# EAGLE schematic scrap (EAGLE 7.1.0)
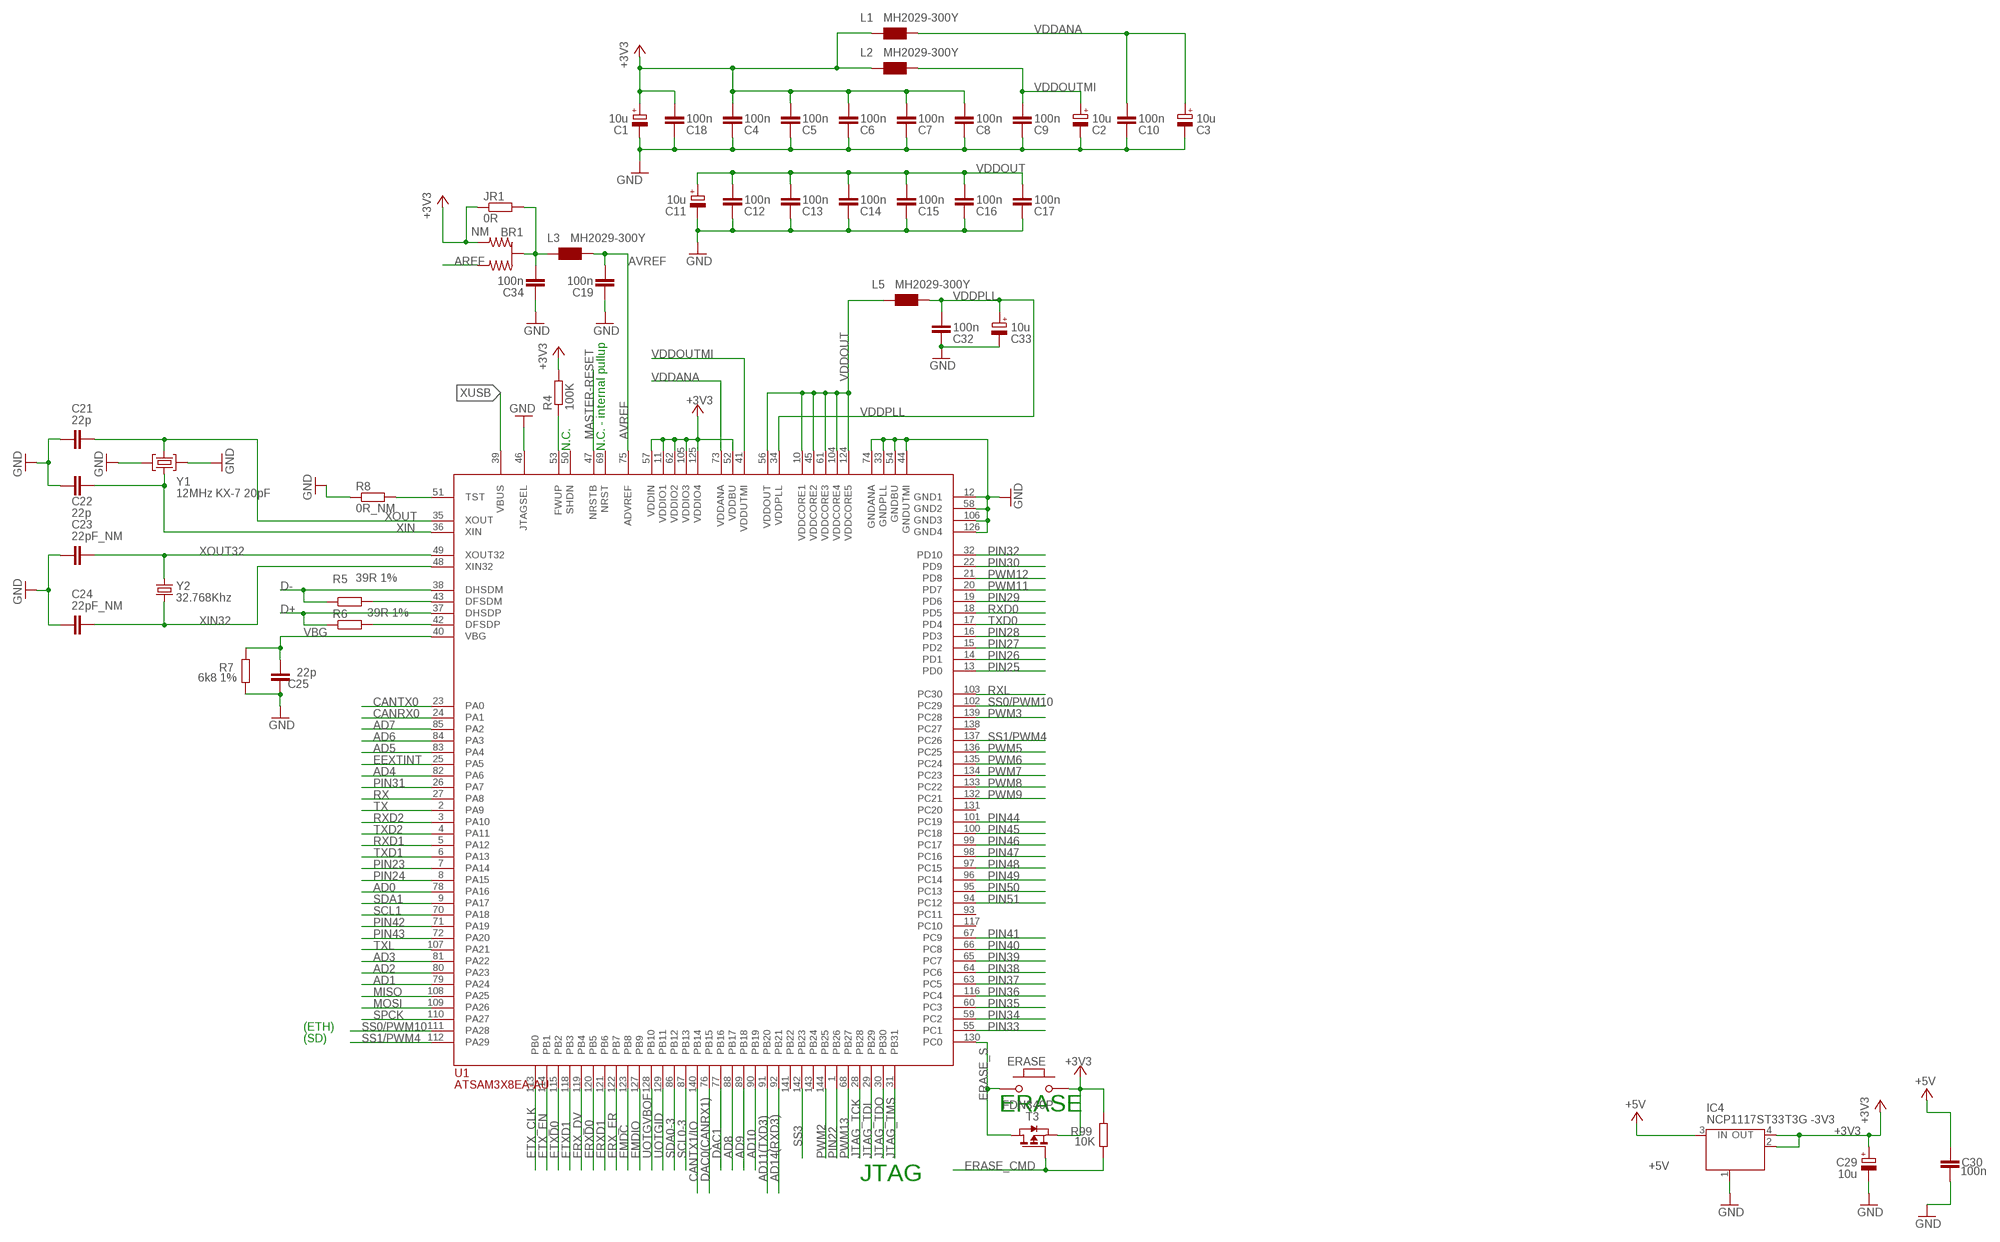
[diagram p0: schematic, sheet 1]

## Parts
BR1  NM  J0402  [J0402]
C1  10u  CPOL-EUSMCB  [SMC_B]
C2  10u  CPOL-EUSMCB  [SMC_B]
C3  10u  CPOL-EUSMCB  [SMC_B]
C4  100n  C-EUC0402  [C0402]
C5  100n  C-EUC0402  [C0402]
C6  100n  C-EUC0402  [C0402]
C7  100n  C-EUC0402  [C0402]
C8  100n  C-EUC0402  [C0402]
C9  100n  C-EUC0402  [C0402]
C10  100n  C-EUC0402  [C0402]
C11  10u  CPOL-EUSMCB  [SMC_B]
C12  100n  C-EUC0402  [C0402]
C13  100n  C-EUC0402  [C0402]
C14  100n  C-EUC0402  [C0402]
C15  100n  C-EUC0402  [C0402]
C16  100n  C-EUC0402  [C0402]
C17  100n  C-EUC0402  [C0402]
C18  100n  C-EUC0402  [C0402]
C19  100n  C-EUC0402  [C0402]
C21  22p  C-EUC0402  [C0402]
C22  22p  C-EUC0402  [C0402]
C23  22pF_NM  C-EUC0402  [C0402]
C24  22pF_NM  C-EUC0402  [C0402]
C25  22p  C-EUC0402  [C0402]
C29  10u  CPOL-EUSMCB  [SMC_B]
C30  100n  C-EUC0402  [C0402]
C32  100n  C-EUC0402  [C0402]
C33  10u  CPOL-EUSMCB  [SMC_B]
C34  100n  C-EUC0402  [C0402]
ERASE  MYSMD_PB157  [SMD_157SW]
IC4  NCP1117ST33T3G -3V3  MC33269ST-3.3T3  [SOT223]
JR1  0R  R-EU_R0402  [R0402]
L1  MH2029-300Y  WE-CBF_0805  [0805]
L2  MH2029-300Y  WE-CBF_0805  [0805]
L3  MH2029-300Y  WE-CBF_0805  [0805]
L5  MH2029-300Y  WE-CBF_0805  [0805]
R4  100K  R-EU_R0402  [R0402]
R5  39R 1%  R-EU_R0402  [R0402]
R6  39R 1%  R-EU_R0402  [R0402]
R7  6k8 1%  R-EU_R0603  [R0603-ROUND]
R8  0R_NM  R-EU_R0402  [R0402]
R99  10K  R-EU_R0402  [R0402]
T3  FDN340P  PMOSSOT23  [SOT-23]
U1  ATSAM3X8EA-AU  ATSAM3X/AAU  [LQFP144]
Y1  12MHz KX-7 20pF  CRYSTAL-3.2-2.5  [CRYSTAL-3.2-2.5]
Y2  32.768Khz  RESONATOR_EPSON_FC_145  [RESONATOR_EPSON_FC_145]

## Nets
+3V3: BR1.3 C1.+ C4.2 C5.2 C6.2 C7.2 C8.2 C18.2 C29.+ ERASE.1 IC4.2(OUT) IC4.4(OUT) JR1.1 L1.1 L2.1 R4.2 R99.2 T3.2(S) U1.11(VDDIO1) U1.52(VDDBU) U1.57(VDDIN) U1.62(VDDIO2) U1.105(VDDIO3) U1.125(VDDIO4)
+5V: C30.2 IC4.3(IN)
AD0: U1.78(PA16)
AD1: U1.79(PA24)
AD2: U1.80(PA23)
AD3: U1.81(PA22)
AD4: U1.82(PA6)
AD5: U1.83(PA4)
AD6: U1.84(PA3)
AD7: U1.85(PA2)
AD8: U1.88(PB17)
AD9: U1.89(PB18)
AD10: U1.90(PB19)
AD11(TXD3): U1.91(PB20)
AD14(RXD3): U1.92(PB21)
AREF: BR1.1
AVREF: C19.2 L3.2 U1.75(ADVREF)
AVREFL: BR1.2(C) C34.2 JR1.2 L3.1
CANRX0: U1.24(PA1)
CANTX0: U1.23(PA0)
CANTX1/IO: U1.140(PB14)
D+ [USBpair]: R6.1 U1.37(DHSDP)
D- [USBpair]: R5.1 U1.38(DHSDM)
DAC0(CANRX1): U1.76(PB15)
DAC1: U1.77(PB16)
EEXTINT: U1.25(PA5)
EMDC: U1.123(PB8)
EMDIO: U1.127(PB9)
ERASE_CMD: R99.1 T3.3(G)
ERASE_S: ERASE.2 T3.1(D) U1.130(PC0)
ERX_DV: U1.119(PB4)
ERX_ER: U1.122(PB7)
ERXD0: U1.120(PB5)
ERXD1: U1.121(PB6)
ETX_CLK: U1.113(PB0)
ETX_EN: U1.114(PB1)
ETXD0: U1.115(PB2)
ETXD1: U1.118(PB3)
GND: C1.- C2.- C3.- C4.1 C5.1 C6.1 C7.1 C8.1 C9.1 C10.1 C11.- C12.1 C13.1 C14.1 C15.1 C16.1 C17.1 C18.1 C19.1 C21.2 C22.2 C23.2 C24.2 C25.2 C29.- C30.1 C32.1 C33.- C34.1 IC4.1(GND/ADJ) R7.1 R8.1 U1.12(GND1) U1.33(GNDPLL) U1.44(GNDUTMI) U1.46(JTAGSEL) U1.54(GNDBU) U1.58(GND2) U1.74(GNDANA) U1.106(GND3) U1.126(GND4) Y1.2(GND) Y1.4(GND)
JTAG_TCK: U1.28(PB28)
JTAG_TDI: U1.29(PB29)
JTAG_TDO: U1.30(PB30)
JTAG_TMS: U1.31(PB31)
MASTER-RESET: U1.47(NRSTB)
MISO: U1.108(PA25)
MOSI: U1.109(PA26)
N$5: R8.2 U1.51(TST)
N$7: R4.1 U1.53(FWUP)
N$11: R5.2 U1.43(DFSDM)
N$12: R6.2 U1.42(DFSDP)
PIN22: U1.1(PB26)
PIN23: U1.7(PA14)
PIN24: U1.8(PA15)
PIN25: U1.13(PD0)
PIN26: U1.14(PD1)
PIN27: U1.15(PD2)
PIN28: U1.16(PD3)
PIN29: U1.19(PD6)
PIN30: U1.22(PD9)
PIN31: U1.26(PA7)
PIN32: U1.32(PD10)
PIN33: U1.55(PC1)
PIN34: U1.59(PC2)
PIN35: U1.60(PC3)
PIN36: U1.116(PC4)
PIN37: U1.63(PC5)
PIN38: U1.64(PC6)
PIN39: U1.65(PC7)
PIN40: U1.66(PC8)
PIN41: U1.67(PC9)
PIN42: U1.71(PA19)
PIN43: U1.72(PA20)
PIN44: U1.101(PC19)
PIN45: U1.100(PC18)
PIN46: U1.99(PC17)
PIN47: U1.98(PC16)
PIN48: U1.97(PC15)
PIN49: U1.96(PC14)
PIN50: U1.95(PC13)
PIN51: U1.94(PC12)
PWM2: U1.144(PB25)
PWM3: U1.139(PC28)
PWM5: U1.136(PC25)
PWM6: U1.135(PC24)
PWM7: U1.134(PC23)
PWM8: U1.133(PC22)
PWM9: U1.132(PC21)
PWM11: U1.20(PD7)
PWM12: U1.21(PD8)
PWM13: U1.68(PB27)
RX: U1.27(PA8)
RXD0: U1.18(PD5)
RXD1: U1.5(PA12)
RXD2: U1.3(PA10)
RXL: U1.103(PC30)
SCL0-3: U1.87(PB13)
SCL1: U1.70(PA18)
SDA0-3: U1.86(PB12)
SDA1: U1.9(PA17)
SPCK: U1.110(PA27)
SS0/PWM10: U1.102(PC29) U1.111(PA28)
SS1/PWM4: U1.112(PA29) U1.137(PC26)
SS3: U1.142(PB23)
TX: U1.2(PA9)
TXD0: U1.17(PD4)
TXD1: U1.6(PA13)
TXD2: U1.4(PA11)
TXL: U1.107(PA21)
UOTGID: U1.129(PB11)
UOTGVBOF: U1.128(PB10)
VBG: C25.1 R7.2 U1.40(VBG)
VDDANA: C3.+ C10.2 L1.2 U1.73(VDDANA)
VDDOUT: C11.+ C12.2 C13.2 C14.2 C15.2 C16.2 C17.2 L5.1 U1.10(VDDCORE1) U1.45(VDDCORE2) U1.56(VDDOUT) U1.61(VDDCORE3) U1.104(VDDCORE4) U1.124(VDDCORE5)
VDDOUTMI: C2.+ C9.2 L2.2 U1.41(VDDUTMI)
VDDPLL: C32.2 C33.+ L5.2 U1.34(VDDPLL)
XIN: C22.1 U1.36(XIN) Y1.1(C1)
XIN32: C24.1 U1.48(XIN32) Y2.P$2
XOUT: C21.1 U1.35(XOUT) Y1.3(C2)
XOUT32: C23.1 U1.49(XOUT32) Y2.P$1
XUSB [usbvcc]: U1.39(VBUS)
Unconnected: U1.50(SHDN) U1.69(NRST) U1.93(PC11) U1.117(PC10) U1.131(PC20) U1.138(PC27) U1.141(PB22) U1.143(PB24)

## Notes on the sheet
- N.C. | N.C. - internal pullup
- (ETH)
- (SD)
- ERASE
- JTAG

## Library data of the parts
BR1 = bibaja:J: Three terminal jumper made from two 0402, 0603, 0805, etc.
C1-C3 C11 C29 C33 = rcl:CPOL-EU: POLARIZED CAPACITOR, European symbol
C4-C10 C12-C19 C21-C25 C30 C32 C34 = SmartPrj:C-EU: CAPACITOR, European symbol
ERASE = SmartPrj:MYSMD_PB157
IC4 = linear:MC33269ST*: Adjustable Output Low Dropout Voltage Regulator 800 mA Source: http://www.onsemi.com/pub/Collateral/MC33269-D.PDF
JR1 R4-R8 R99 = SmartPrj:R-EU_: RESISTOR, European symbol
L1-L3 L5 = wuerth-elektronik:WE-CBF: SMD EMI Suppression Ferrite Beads - excellent anti-EMI properties - low DCR - impedances till 3000 ohms - rated current up to 6 A
T3 = zetex:PMOSSOT23: MOS FET
U1 = SmartPrj:ATSAM3X/A
Y1 = SmartPrj:CRYSTAL-3.2-2.5
Y2 = Arduino_Wifi_shield_v018_tG:RESONATOR_EPSON_FC_145

## Net classes
0 default: width 0.203 mm, drill 0.406 mm, clearance 0.203 mm
1 USB: width 0.203 mm, drill 0.406 mm, clearance 0.203 mm
2 gnd: width 0.203 mm, drill 0.406 mm, clearance 0.203 mm
3 usbvcc: width 0.203 mm, drill 0.406 mm, clearance 0.203 mm
4 USBpair: width 0.254 mm, drill 0.406 mm, clearance 0.61 mm